# Altium schematic sheet PLD_Connectors_Piggyback.SchDoc: Connectors - Piggyback
size A4; SheetTotal: 32
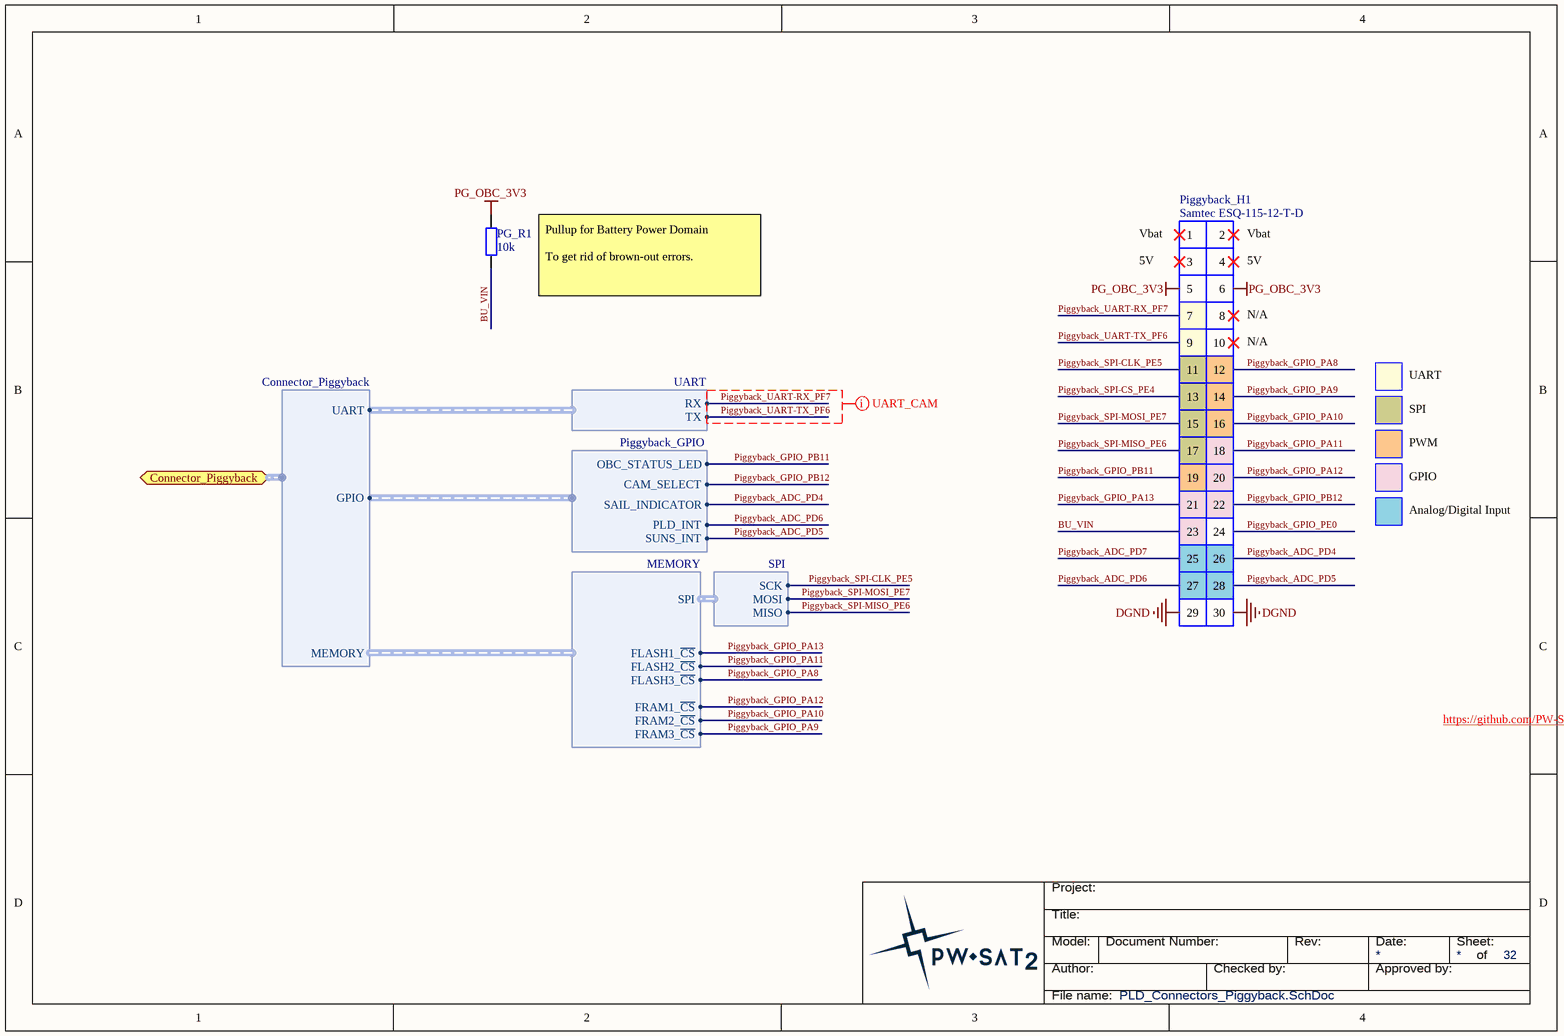
[diagram p0: PLD_Connectors_Piggyback.SchDoc]

## Parts
PG_R1  10k  [SMD_Resistor_0603]
Piggyback_H1  Samtec ESQ-115-12-T-D  [Samtec_ESQ-115-12-T-D]

## Ports
Connector_Piggyback (harness Connector_Piggyback)

## Harnesses
SPI: MISO, MOSI, SCK
UART: RX, TX
Connector_Piggyback: UART, GPIO, MEMORY
Piggyback_GPIO: CAM_SELECT, PLD_INT, SAIL_INDICATOR, SUNS_INT, OBC_STATUS_LED
MEMORY: SPI, FLASH1_~{CS}, FRAM1_~{CS}, FLASH2_~{CS}, FLASH3_~{CS}, FRAM2_~{CS}, FRAM3_~{CS}

## Nets
DGND: Piggyback_H1.29 Piggyback_H1.30
PG_OBC_3V3: PG_R1.2 Piggyback_H1.5 Piggyback_H1.6
BU_VIN: PG_R1.1 Piggyback_H1.23
Piggyback_ADC_PD4: Piggyback_H1.26 ; harness Piggyback_GPIO.SAIL_INDICATOR
Piggyback_ADC_PD5: Piggyback_H1.28 ; harness Piggyback_GPIO.SUNS_INT
Piggyback_ADC_PD6: Piggyback_H1.27 ; harness Piggyback_GPIO.PLD_INT
Piggyback_ADC_PD7: Piggyback_H1.25
Piggyback_GPIO_PA8: Piggyback_H1.12 ; harness MEMORY.FLASH3_~{CS}
Piggyback_GPIO_PA9: Piggyback_H1.14 ; harness MEMORY.FRAM3_~{CS}
Piggyback_GPIO_PA10: Piggyback_H1.16 ; harness MEMORY.FRAM2_~{CS}
Piggyback_GPIO_PA11: Piggyback_H1.18 ; harness MEMORY.FLASH2_~{CS}
Piggyback_GPIO_PA12: Piggyback_H1.20 ; harness MEMORY.FRAM1_~{CS}
Piggyback_GPIO_PA13: Piggyback_H1.21 ; harness MEMORY.FLASH1_~{CS}
Piggyback_GPIO_PB11: Piggyback_H1.19 ; harness Piggyback_GPIO.OBC_STATUS_LED
Piggyback_GPIO_PB12: Piggyback_H1.22 ; harness Piggyback_GPIO.CAM_SELECT
Piggyback_GPIO_PE0: Piggyback_H1.24
Piggyback_SPI-CLK_PE5: Piggyback_H1.11 ; harness SPI.SCK
Piggyback_SPI-CS_PE4: Piggyback_H1.13
Piggyback_SPI-MISO_PE6: Piggyback_H1.17 ; harness SPI.MISO
Piggyback_SPI-MOSI_PE7: Piggyback_H1.15 ; harness SPI.MOSI
Piggyback_UART-RX_PF7: Piggyback_H1.7 ; harness UART.RX
Piggyback_UART-TX_PF6: Piggyback_H1.9 ; harness UART.TX

Not connected (* = marked no-connect by the designer): Piggyback_H1 1* 2* 3* 4* 8* 10*

## Layout directives
net class UART_CAM: Piggyback_UART-RX_PF7, Piggyback_UART-TX_PF6

## Notes on the sheet
- (near Piggyback_H1) Vbat
- (near PG_R1) Pullup for Battery Power Domain
  To get rid of brown-out errors.
- (near Piggyback_H1) 5V
- (near Piggyback_H1) N/A
- UART
- SPI
- PWM
- GPIO
- Analog/Digital Input
- https://github.com/PW-Sat2/Documentation/raw/master/obc/obc_datasheet_esl_cubecomputer.pdf
- Title:
- Project:
- Author:
- Model:
- Document Number:
- Checked by:
- Rev:
- Date:
- Approved by:
- Sheet:
- of
- File name:

## Library data of the parts
PG_R1 = Res: Value: 10k; Package: 0603
Piggyback_H1 = Samtec_ESQ-115-xx-x-D: Samtec ESQ Series Header , 2.54mm pitch, 2x15pin. PC-104 Stack Connector.; HelpUrl: http://suddendocs.samtec.com/catalog_english/esq_th.pdf; Value: Samtec ESQ-115-12-T-D